# Altium schematic sheet LOG.SchDoc
size A4; SheetNumber: 2; SheetTotal: 5
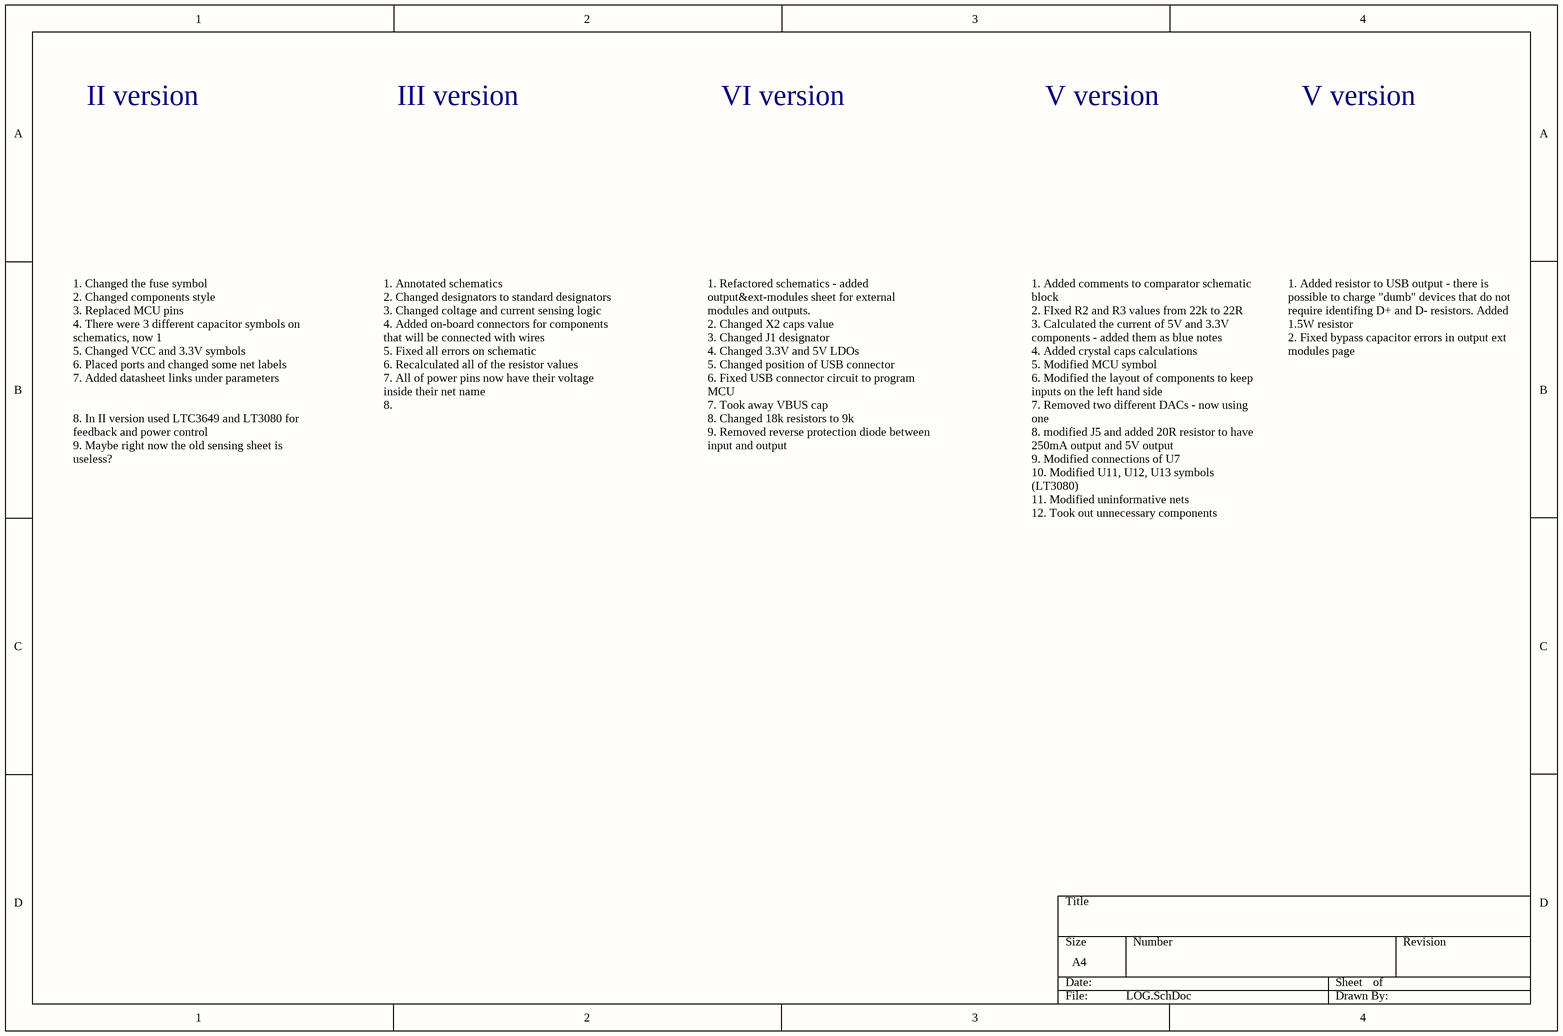
[diagram p0: LOG.SchDoc]

## Notes on the sheet
- II version
- III version
- VI version
- V version
- 1. Changed the fuse symbol
  2. Changed components style
  3. Replaced MCU pins
  4. There were 3 different capacitor symbols on schematics, now 1
  5. Changed VCC and 3.3V symbols
  6. Placed ports and changed some net labels
  7. Added datasheet links under parameters
  8. In II version used LTC3649 and LT3080 for feedback and power control
  9. Maybe right now the old sensing sheet is useless?
- 1. Annotated schematics
  2. Changed designators to standard designators
  3. Changed coltage and current sensing logic
  4. Added on-board connectors for components that will be connected with wires
  5. Fixed all errors on schematic
  6. Recalculated all of the resistor values
  7. All of power pins now have their voltage inside their net name
  8.
- 1. Refactored schematics - added output&ext-modules sheet for external modules and outputs.
  2. Changed X2 caps value
  3. Changed J1 designator
  4. Changed 3.3V and 5V LDOs
  5. Changed position of USB connector
  6. Fixed USB connector circuit to program MCU
  7. Took away VBUS cap
  8. Changed 18k resistors to 9k
  9. Removed reverse protection diode between input and output
- 1. Added comments to comparator schematic block
  2. FIxed R2 and R3 values from 22k to 22R
  3. Calculated the current of 5V and 3.3V components - added them as blue notes
  4. Added crystal caps calculations
  5. Modified MCU symbol
  6. Modified the layout of components to keep inputs on the left hand side
  7. Removed two different DACs - now using one
  8. modified J5 and added 20R resistor to have 250mA output and 5V output
  9. Modified connections of U7
  10. Modified U11, U12, U13 symbols (LT3080)
  11. Modified uninformative nets
  12. Took out unnecessary components
- 1. Added resistor to USB output - there is possible to charge "dumb" devices that do not require identifing D+ and D- resistors. Added 1.5W resistor
  2. Fixed bypass capacitor errors in output ext modules page